# Altium schematic sheet Dual_Flowmeter.SchDoc
size A; SheetNumber: 15; SheetTotal: 15
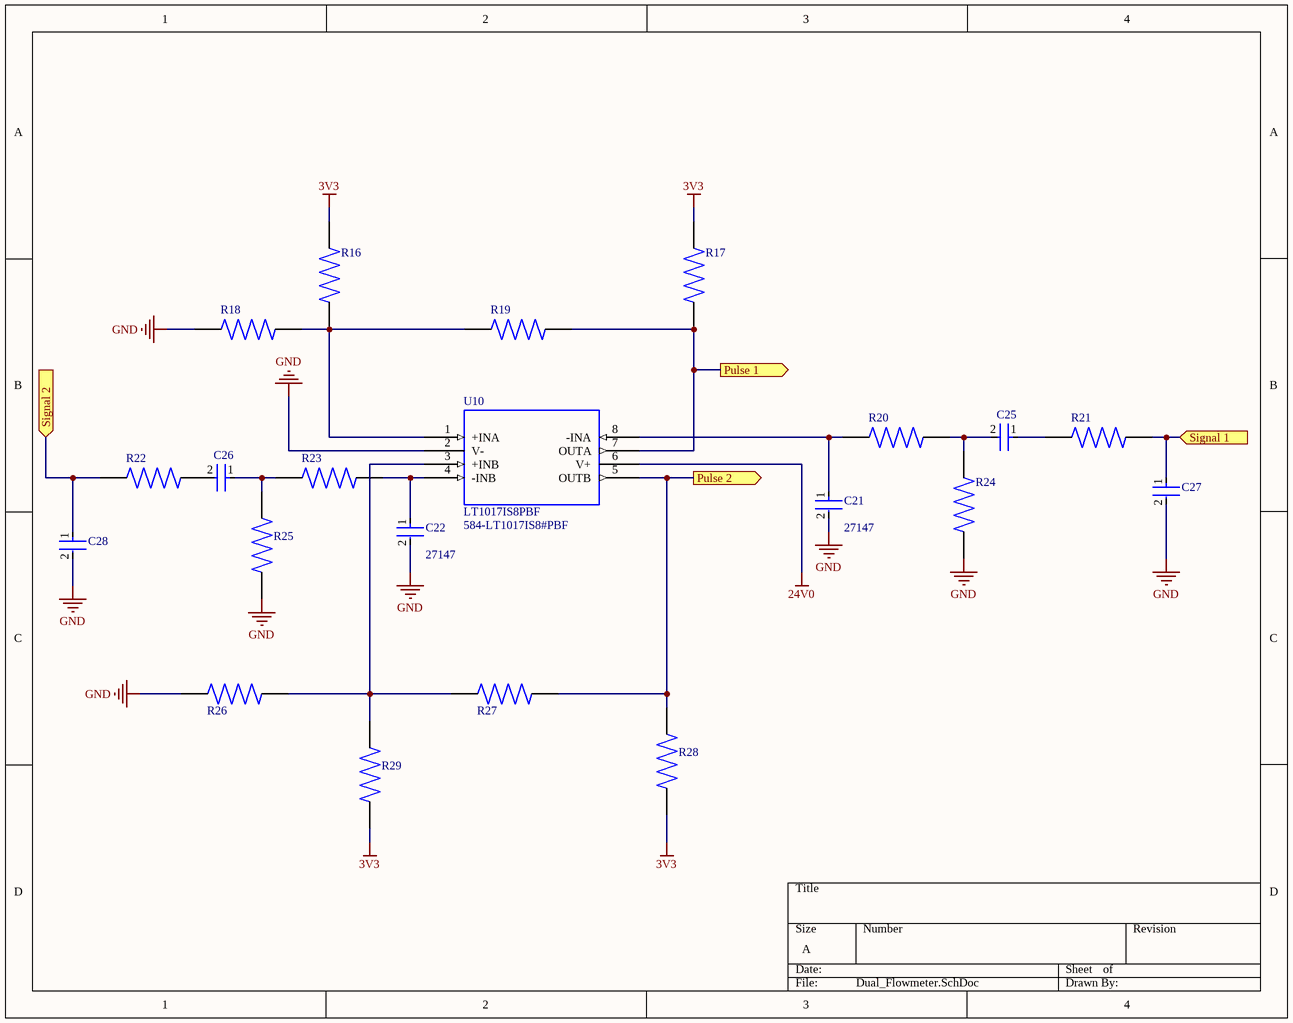
[diagram p0: Dual_Flowmeter.SchDoc]

## Parts
C21  Stock 1: 27147  [FP-C1206C-EB-IPC_A]  (hidden comment: C1206C222K5RACTU)
C22  Stock 1: 27147  [FP-C1206C-EB-IPC_A]  (hidden comment: C1206C222K5RACTU)
C25  GRM21BR61E106KA73L  [FP-GRM21B-0_15-IPC_A]  (value not drawn)
C26  GRM21BR61E106KA73L  [FP-GRM21B-0_15-IPC_A]  (value not drawn)
C27  GRM21BR61E106KA73L  [FP-GRM21B-0_15-IPC_A]  (value not drawn)
C28  GRM21BR61E106KA73L  [FP-GRM21B-0_15-IPC_A]  (value not drawn)
R16  RC1206JR-07100KL  [RESC3116X65N]  (value not drawn)
R17  RC0402FR-073K3P  [RESC1005X40N]  (value not drawn)
R18  CRS2010AFX-1001ELF  [RESC5025X70N]  (value not drawn)
R19  ERJS03F1004V  [RES_ERJS03F1004V]  (value not drawn)
R20  CR0603-JW-512ELF  [RESC1608X55N]  (value not drawn)
R21  RT0603DRE072K21L  [RESC1608X55N]  (value not drawn)
R22  RT0603DRE072K21L  [RESC1608X55N]  (value not drawn)
R23  CR0603-JW-512ELF  [RESC1608X55N]  (value not drawn)
R24  CR0603-JW-512ELF  [RESC1608X55N]  (value not drawn)
R25  CR0603-JW-512ELF  [RESC1608X55N]  (value not drawn)
R26  CRS2010AFX-1001ELF  [RESC5025X70N]  (value not drawn)
R27  ERJS03F1004V  [RES_ERJS03F1004V]  (value not drawn)
R28  RC0402FR-073K3P  [RESC1005X40N]  (value not drawn)
R29  RC1206JR-07100KL  [RESC3116X65N]  (value not drawn)
U10  LT1017IS8PBF  Supplier Part Number 1: 584-LT1017IS8#PBF  [SO-8_S]

## Ports
Pulse 1 (out), Pulse 2 (out), Signal 1 (in), Signal 2 (in)

## Nets
3V3: R16.1 R17.1 R28.1 R29.1
24V0: U10.6(V+)
GND: C21.2 C22.2 C27.2 C28.2 R18.1 R24.2 R25.2 R26.2 U10.2(V-)
Pulse 1: R17.2 R19.2 U10.7(OUTA) ; port Pulse 1
Pulse 2: R27.1 R28.2 U10.5(OUTB) ; port Pulse 2
Signal 1: C27.1 R21.2 ; port Signal 1
Signal 2: C28.1 R22.1 ; port Signal 2
NetC21_1: C21.1 R20.1 U10.8(-INA)
NetC22_1: C22.1 R23.2 U10.4(-INB)
NetC25_1: C25.1 R21.1
NetC25_2: C25.2 R20.2 R24.1
NetC26_1: C26.1 R23.1 R25.1
NetC26_2: C26.2 R22.2
NetR16_2: R16.2 R18.2 R19.1 U10.1(+INA)
NetR26_1: R26.1 R27.2 R29.2 U10.3(+INB)

## Library data of the parts
C21 C22 = C1206C222K5RACTU: CAPACITOR SMD Multilayer Ceramic MLCC 1206 Case 2200pF ±10% 50Vdc X7R Dielectric -55°C~+125°C T/R; Manufacturer: KEMET; Capacitance: 2.2nF; Voltage Rating: 50V; Supplier 1: Digi-Key; Manufacturer Part Number: C1206C222K5RACTU; RoHS: Yes; Category: Ceramic Capacitors; Pricing 1: 1=0.23000, 10=0.16000, 50=0.09600, 100=0.08110, 500=0.05548, 1000=0.04908 (USD); Mount: Surface Mount,PCB; Case/Package: 1206; Case Code (Imperial): 1206; Case Code (Metric): 3216; Dielectric Material: Ceramic; Min Operating Temperature: -55°C; Max Operating Temperature: 125°C; Packaging: Tape and Reel; Package Quantity: 1; Tolerance: 10%; Voltage Rating (DC): 50V; Termination: SMD/SMT; Series: C; Dielectric: X7R; Voltage: 50V; Construction: Flat; Length: 3.2mm; Width: 0.063inch; Height: 0.78mm; Depth: 1.6mm; Thickness: 0.035inch; Radiation Hardening: No; REACH SVHC: No SVHC; RoHS Compliant: Yes; ComponentLink1URL: https://datasheet.ciiva.com/14589/70095383-14589254.pdf?src-supplier=Allied+Electronics; ComponentLink1Description: https://datasheet.ciiva.com/14589/70095383-14589254.pdf?src-supplier=Allied+Electronics; ComponentLink2URL: https://datasheet.ciiva.com/14606/70095383-14606284.pdf?src-supplier=Allied+Electronics; ComponentLink2Description: https://datasheet.ciiva.com/14606/70095383-14606284.pdf?src-supplier=Allied+Electronics; ComponentLink3URL: https://datasheet.ciiva.com/28693/1851736-28693015.pdf?src-supplier=Element14; ComponentLink3Description: https://datasheet.ciiva.com/28693/1851736-28693015.pdf?src-supplier=Element14; ComponentLink4URL: https://datasheet.ciiva.com/46443/1851736-46443542.pdf?src-supplier=Element14; ComponentLink4Description: https://datasheet.ciiva.com/46443/1851736-46443542.pdf?src-supplier=Element14; ComponentLink5URL: https://datasheet.ciiva.com/46385/1851736-46385639.pdf?src-supplier=Element14; ComponentLink5Description: https://datasheet.ciiva.com/46385/1851736-46385639.pdf?src-supplier=Element14; Supplier Part Number 1: 399-C1206C222K5RAC7800CT-ND
C25-C28 = GRM21BR61E106KA73L: 0805 10 uF 25 V ±10% Tolerance X5R SMT Multilayer Ceramic Capacitor; Manufacturer: Murata; Capacitance: 10uF; Voltage Rating: 25V; Supplier 1: Mouser; Manufacturer Part Number: GRM21BR61E106KA73L; RoHS: Yes; Category: Ceramic Capacitors; Pricing 1: 1=0.24000, 10=0.16400, 50=0.16400, 100=0.08400, 1000=0.08400, 6000=0.07600, 9000=0.06200, 10000=0.06200, 24000=0.05400 (USD); Mount: Surface Mount; Case/Package: 0805; Case Code (Metric): 2012; Case Code (Imperial): 0805; Material: Ceramic; Min Operating Temperature: -55°C; Max Operating Temperature: 85°C; Package Quantity: 1; Tolerance: 10%; Packaging: Tape and Reel; Voltage Rating (DC): 25V; Termination: SMD/SMT; Voltage: 25V; Series: GRM; Construction: Flat; Dielectric: X5R; Length: 2mm; Width: 0.049inch; Height: 1.25mm; Depth: 1.25mm; Thickness: 0.053inch; Radiation Hardening: No; REACH SVHC: Unknown; RoHS Compliant: Yes; Lead Free: Lead Free; ComponentLink1URL: https://datasheet.ciiva.com/22774/1747469-22774396.pdf?src-supplier=Farnell; ComponentLink1Description: https://datasheet.ciiva.com/22774/1747469-22774396.pdf?src-supplier=Farnell; ComponentLink2URL: https://datasheet.ciiva.com/5424/product-5424327.pdf?src-supplier=Mouser; ComponentLink2Description: https://datasheet.ciiva.com/5424/product-5424327.pdf?src-supplier=Mouser; ComponentLink3URL: https://datasheet.ciiva.com/16440/grm21br61e106ka73l-16440627.pdf?src-supplier=Future+Electronics; ComponentLink3Description: https://datasheet.ciiva.com/16440/grm21br61e106ka73l-16440627.pdf?src-supplier=Future+Electronics; ComponentLink4URL: https://datasheet.ciiva.com/28584/626718-28584288.pdf?src-supplier=Element14; ComponentLink4Description: https://datasheet.ciiva.com/28584/626718-28584288.pdf?src-supplier=Element14; ComponentLink5URL: https://datasheet.ciiva.com/29199/454623-da-01-en-vs-kondensator-0805-29199615.pdf?src-supplier=Conrad; ComponentLink5Description: https://datasheet.ciiva.com/29199/454623-da-01-en-vs-kondensator-0805-29199615.pdf?src-supplier=Conrad; ComponentLink6URL: https://datasheet.ciiva.com/139/partnumbering-e-01-139182.pdf?src-supplier=Digi-Key; ComponentLink6Description: https://datasheet.ciiva.com/139/partnumbering-e-01-139182.pdf?src-supplier=Digi-Key; ComponentLink7URL: https://datasheet.ciiva.com/139/partnumbering-e-01-139183.pdf?src-supplier=Digi-Key; ComponentLink7Description: https://datasheet.ciiva.com/139/partnumbering-e-01-139183.pdf?src-supplier=Digi-Key; ComponentLink8URL: https://datasheet.ciiva.com/139/partnumbering-e-01-139184.pdf?src-supplier=Digi-Key; ComponentLink8Description: https://datasheet.ciiva.com/139/partnumbering-e-01-139184.pdf?src-supplier=Digi-Key; ComponentLink9URL: https://datasheet.ciiva.com/28584/626718-28584279.pdf?src-supplier=Element14; ComponentLink9Description: https://datasheet.ciiva.com/28584/626718-28584279.pdf?src-supplier=Element14; ComponentLink10URL: https://datasheet.ciiva.com/7719/1747469-7719093.pdf?src-supplier=Element14; ComponentLink10Description: https://datasheet.ciiva.com/7719/1747469-7719093.pdf?src-supplier=Element14; ComponentLink11URL: https://datasheet.ciiva.com/14116/grmseries-highdielectrictype-eng-14116376.pdf?src-supplier=Distrelec; ComponentLink11Description: https://datasheet.ciiva.com/14116/grmseries-highdielectrictype-eng-14116376.pdf?src-supplier=Distrelec; Supplier Part Number 1: 81-GRM21BR61E106KA3L; Stock 1: 513087
R16 R29 = RC1206JR-07100KL: Carbon film resistor 100 kâ„¦ SMD 1206 0.25 W 5 % 200 ppm Yageo RC1206JR-07100KL 1 pc(s); Package: None; Price: None; Value: *; MP: RC1206JR-07100KL; Availability: Unavailable; Supplier 1: Digi-Key; Supplier Part Number 1: 311-100KERCT-ND
R17 R28 = RC0402FR-073K3P: Chip Resistor Surface Mount; Package: None; Price: None; Value: *; MP: RC0402FR-073K3P; Availability: Unavailable; Supplier 1: Digi-Key; Supplier Part Number 1: YAG1267CT-ND
R19 R27 = ERJS03F1004V: Res Thick Film 0603 1M Ohm 1% 0.1W(1/10W) Â±100ppm/Â°C Sulfur Resistant Pad SMD Automotive T/R; MP: ERJ-S03F1004V; MF: Panasonic; Availability: Not in stock; Value: *; Price: None; SnapEDA_Link: https://www.snapeda.com/parts/ERJ-S03F1004V/Panasonic/view-part/3733497/?ref=snap; Check_prices: https://www.snapeda.com/parts/ERJ-S03F1004V/Panasonic/view-part/3733497/?ref=eda; Package: 1608-2 Panasonic; Supplier 1: Mouser; Supplier Part Number 1: 667-ERJ-S03F1004V
R20 R23-R25 = CR0603-JW-512ELF: Resistor Thick Film 0603 5.1k Ohm 5% 1/10 Watt Â±200ppm Â°C Surface Mount Paper Tape On Plastic Reel; Package: None; Price: None; Value: *; MP: CR0603-JW-512ELF; Availability: Unavailable; Supplier 1: Digi-Key; Supplier Part Number 1: 118-CR0603-JW-512ELFCT-ND
R21 R22 = RT0603DRE072K21L: RES SMD 2.21KOHM 0.5% 1/10W 0603; Package: None; Price: None; Value: *; MP: RT0603DRE072K21L; Availability: Unavailable
U10 = LT1017IS8PBF: Comparator General Purpose Pull Up 8-SOIC; MF: Analog Devices; MP: LT1017IS8#PBF; Purchase-URL: https://pricing.snapeda.com/search/part/LT1017IS8#PBF/?ref=eda; Check_prices: https://www.snapeda.com/parts/LT1017IS8%23PBF/Analog%20Devices/view-part/4348316/?ref=eda; Value: *; Package: SOIC -8 Analog Devices; Price: None; Availability: In Stock; SnapEDA_Link: https://www.snapeda.com/parts/LT1017IS8%23PBF/Analog%20Devices/view-part/4348316/?ref=snap; Supplier 1: Mouser
R18 R26 = CRS2010AFX-1001ELF: Package: None; Price: None; Value: *; MP: CRS2010AFX-1001ELF; Availability: Unavailable; Supplier 1: Digi-Key; Supplier Part Number 1: CRS2010AFX-1001ELFCT-ND